# EAGLE design Finalpart2 (EAGLE 9.6.2)
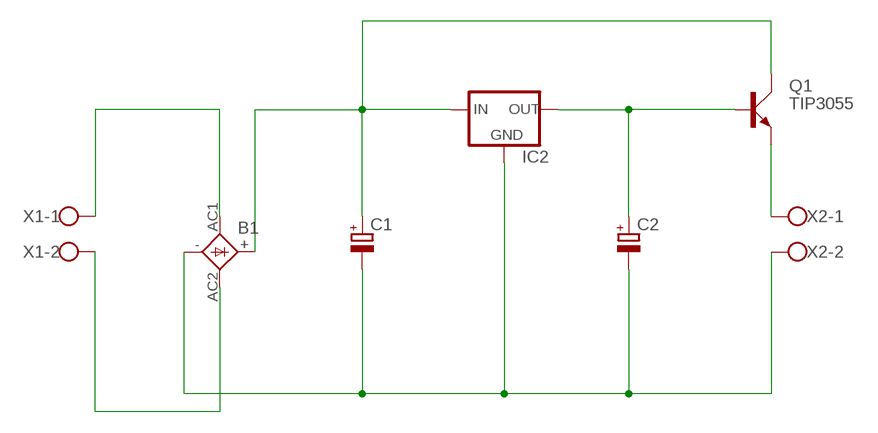
[diagram p0: schematic, sheet 1]

## Parts
B1  FB32  [FB32]
C1  CPOL-EUE7.5-16  [E7,5-16]
C2  CPOL-EUE3.5-8  [E3,5-8]
IC2  78XXL  [78XXL]
Q1  TIP3055  [TOP3AV]
X1  W237-102  [W237-102]
X2  W237-102  [W237-102]

## Nets
N$1: B1.AC1 X1.1
N$2: B1.AC2 X1.2
N$3: Q1.E X2.1
N$5: B1.+ C1.+ IC2.IN Q1.C
N$6: B1.- C1.- C2.- IC2.GND X2.2
N$8: C2.+ IC2.OUT Q1.B

## Library data of the parts
B1 = rectifier:FB32: FAGOR RECTIFIER grid 1 x 10,2 x 7,5 mm
C1 C2 = rcl:CPOL-EU: POLARIZED CAPACITOR, European symbol; SPICEPREFIX: C
IC2 = v-reg:78XXL: VOLTAGE REGULATOR
Q1 = transistor-power:TIP3055: NPN TRANSISTOR
X1 X2 = con-wago-500:W237-102: WAGO SCREW CLAMP; MPN: 237-102; OC_FARNELL: unknown; OC_NEWARK: 70K9898

## Board
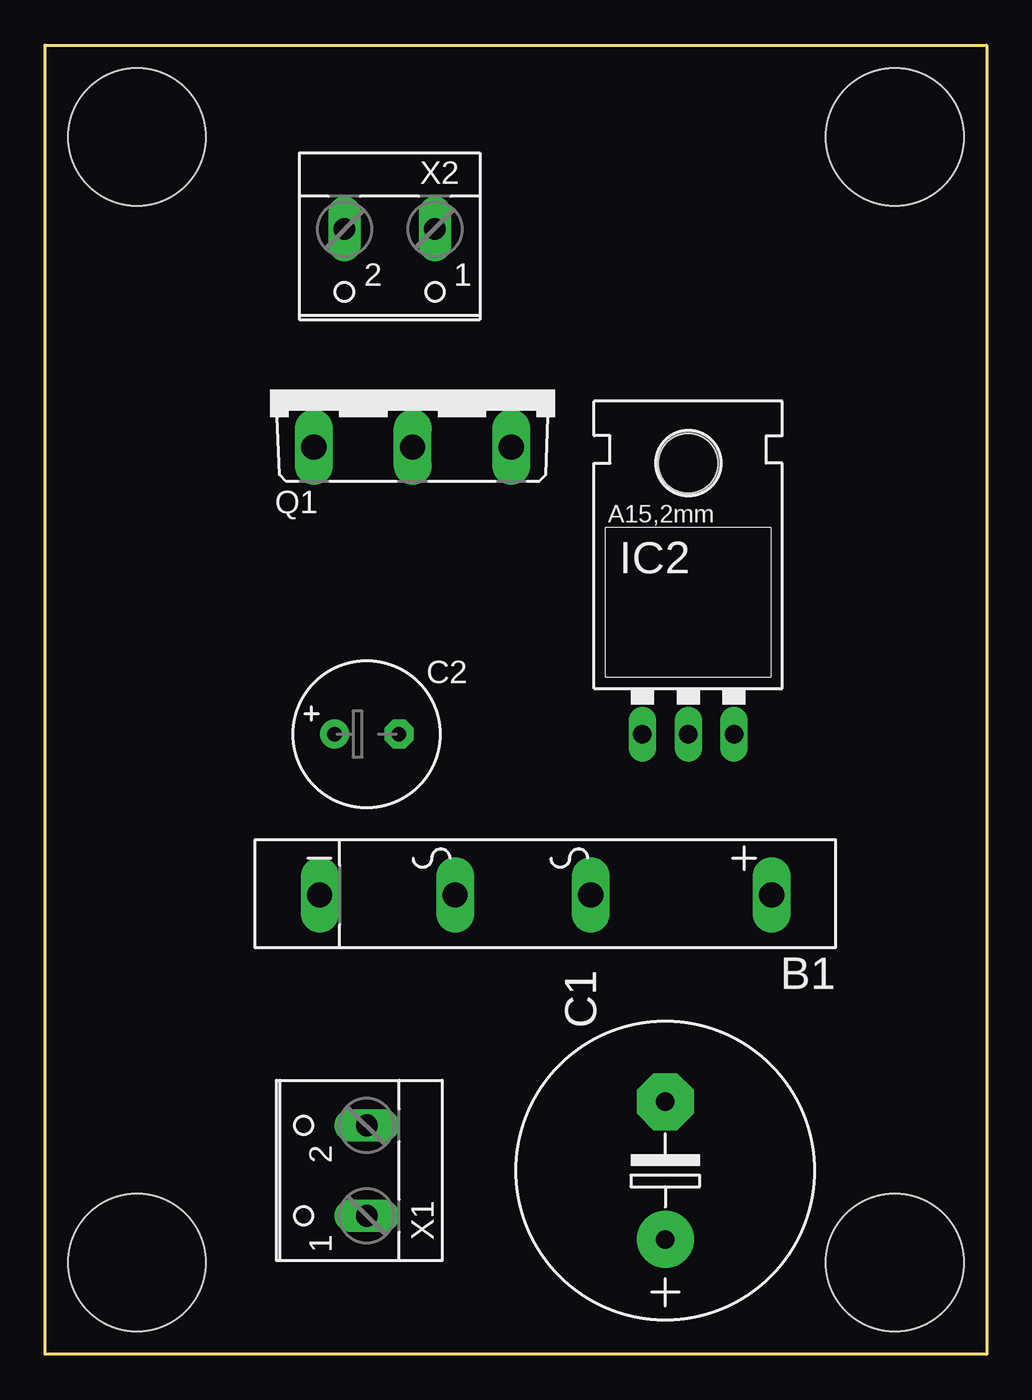
[diagram p1: board, top side]
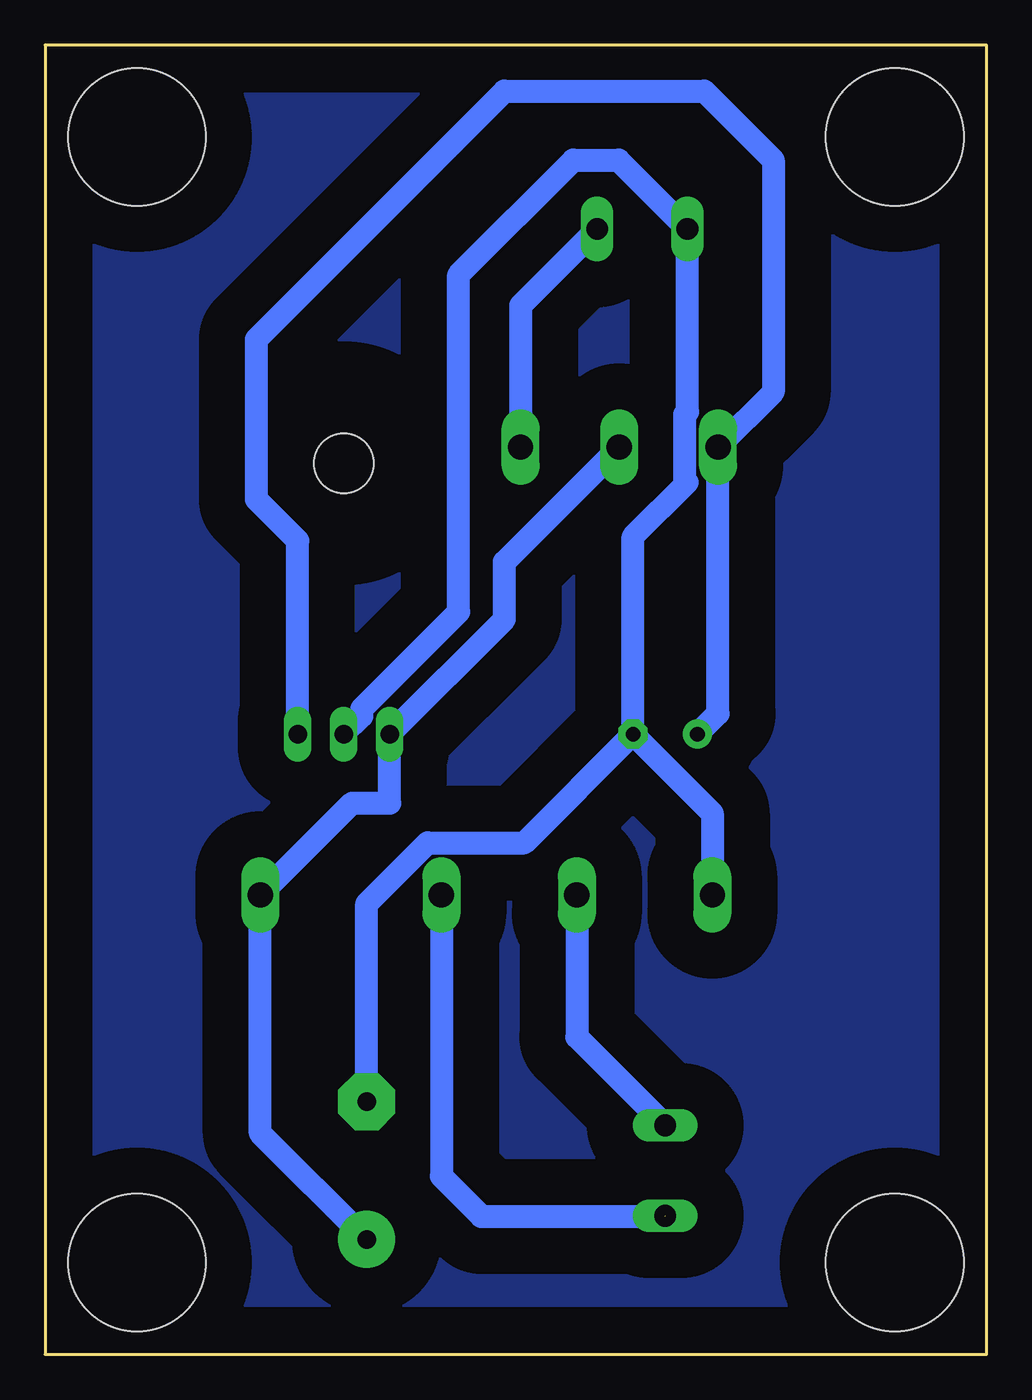
[diagram p2: board, bottom side, seen from below]

Size 52.07 x 72.39 mm. Coordinates in mm from the lower left corner, seen from the top.
Outline: 0,72.39 52.07,72.39 52.07,0 0,0 0,72.39
Copper layers (1*16): Top 0.035mm / dielectric 1.5mm / Bottom 0.035mm
Design rules "default": minimum track width 6mil, minimum drill 0.35mm, track to track 6mil, track to pad 6mil, pad to pad 6mil, via to via 6mil, smd to smd 6mil, copper to edge 40mil, drill to drill 6mil, minimum pad ring 10mil, minimum via ring 8mil, stop-mask expansion 4mil, vias tented up to drill 0mil, thermal gap 10mil
Holes 7.62 mm at 5.08,67.31 46.99,67.31 46.99,5.08 5.08,5.08

### Footprints (pad centres in the part's own frame; a part is rotated, then mirrored left to right if it is on the bottom)
FB32 = drill 1.397 long: + -13.5,0; - 11.494,0; AC1 -3.492,0; AC2 4.001,0
E7,5-16 = drill 1.016 pad 3.15: + -3.81,0 | drill 1.016 pad 3.15 octagon: - 3.81,0
E3,5-8 = drill 0.813 pad 1.6: + -1.778,0 | drill 0.813 pad 1.6 octagon: - 1.778,0
78XXL = drill 1.016 long: GND 0,-3.81; IN -2.54,-3.81; OUT 2.54,-3.81 | hole 3.302: 0,11.176
TOP3AV = drill 1.397 long: B -5.461,-3.175; C 0,-3.175; E 5.461,-3.175
W237-102 = drill 1.194 long: 1 -2.5,-1.27; 2 2.5,-1.27

### Placement (x,y rotation side)
B1  26.67,25.4 180 top
C1  34.29,10.16 90 top
C2  17.78,34.29 0 top
IC2  35.56,38.1 0 top
Q1  20.32,53.34 0 top
X1  16.51,10.16 90 top
X2  19.05,60.96 180 top

### Tracks (layer width: path | path; a pad name or v marks a point on that pad's centre or on a via)
GROUND
  pour Bottom (isolate 2.54): 0,72.39 52.07,72.39 52.07,0 1.27,0 0,1.27
N$1  (1 unrouted)
  Bottom 1.27: B1.AC1 30.16,9.84 27.94,7.62 17.78,7.62
N$2
  Bottom 1.27: B1.AC2 22.67,17.55 X1.2
N$3
  Bottom 1.27: X2.1 25.78,58 Q1.E
N$5
  Bottom 1.27: C1.+ 40.17,12.23 B1.+ 35.09,30.48 33.02,30.48 IC2.IN 26.67,40.64 26.67,43.82 Q1.C
N$6
  Bottom 1.27: C2.- 15.18,29.91 B1.- | C2.- 25.56,28.28 30.92,28.28 34.29,24.91 C1.- | C2.- 19.56,45.21 16.55,48.22 16.69,48.36 16.69,51.97 16.55,52.12 X2.2 20.36,66.04 22.86,66.04 29.21,59.69 29.21,41.05 34.57,35.69 34.57,35.28 IC2.GND
N$8
  Bottom 1.27: C2.+ 14.86,35.43 Q1.B 11.81,53.21 11.81,66.04 15.62,69.85 26.67,69.85 40.39,56.13 40.39,47.28 38.1,44.99 IC2.OUT